# EAGLE schematic EchidnaBlack_0 (EAGLE 6.5.0)
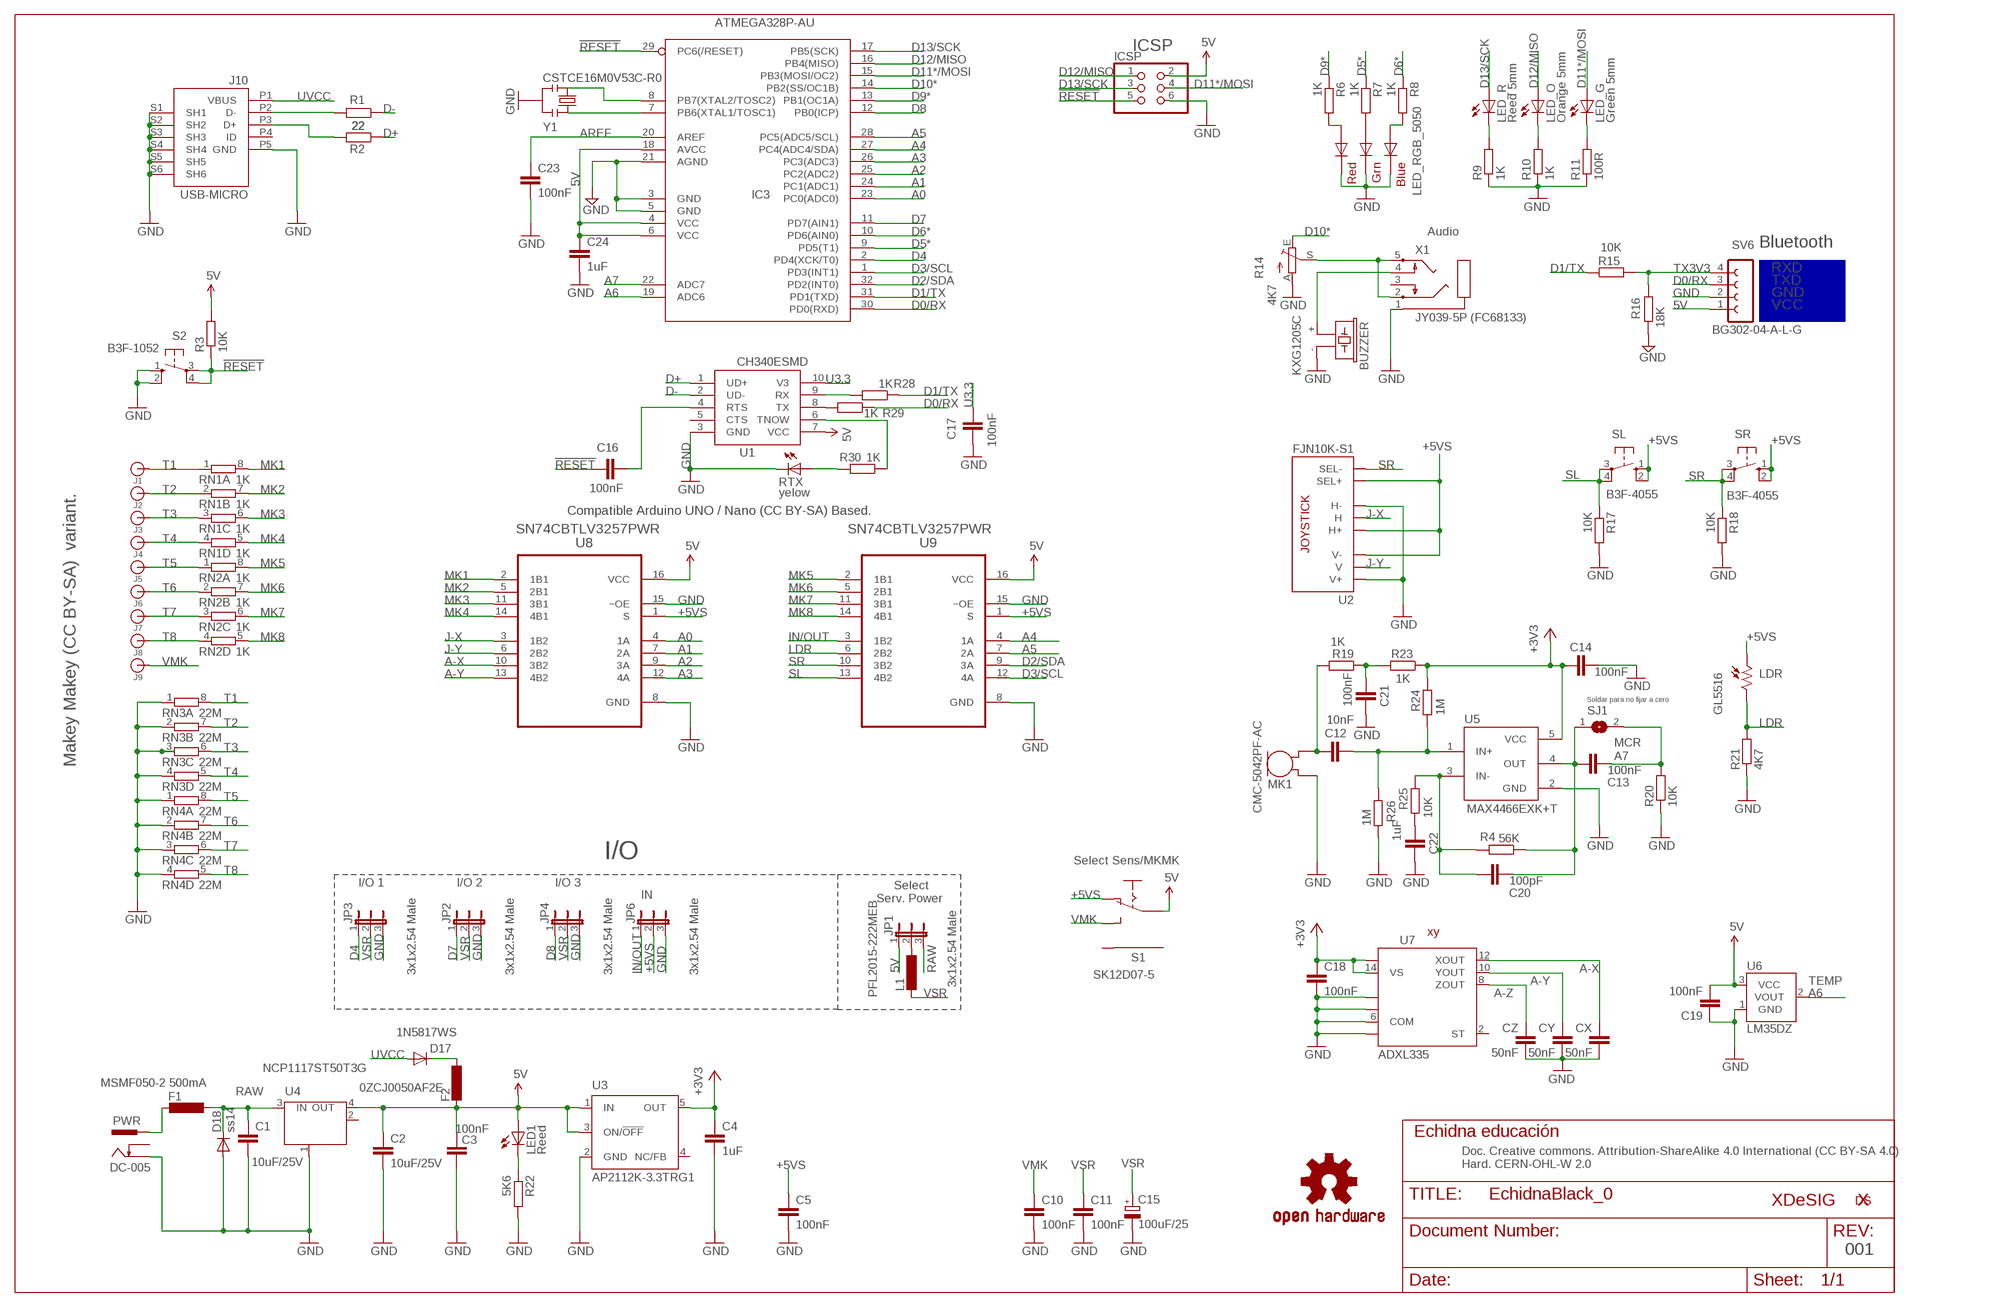
[diagram p0: schematic, sheet 1]

## Parts
BUZZER  KXG1205C  F/CM12P  [F/CM12P]
C1  10uF/25V  C-EUC1210  [C1210]
C2  10uF/25V  C-EUC1210  [C1210]
C3  100nF  CAP0603-CAP  [0603-CAP]
C4  1uF  CAP0603-CAP  [0603-CAP]
C5  100nF  C-EUC0603K  [C0603K]
C10  100nF  C-EUC0603K  [C0603K]
C11  100nF  C-EUC0603K  [C0603K]
C12  10nF  C-EUC0603K  [C0603K]
C13  100nF  C-EUC0603K  [C0603K]
C14  100nF  C-EUC0603K  [C0603K]
C15  100uF/25  CPOL-EUD  [PANASONIC_D]
C16  100nF  0015_100NF_0603  [C0603-ROUND]
C17  100nF  0015_100NF_0603  [C0603-ROUND]
C18  100nF  C-EUC0603K  [C0603K]
C19  100nF  C-EUC0603K  [C0603K]
C20  100pF  C-EUC0603K  [C0603K]
C21  100nF  C-EUC0603K  [C0603K]
C22  1uF  C-EUC0603K  [C0603K]
C23  100nF  0015_100NF_0603  [C0603-ROUND]
C24  1uF  0006_1UF_0603/GRM188R61E105KA12D  [C0603-ROUND]
CX  50nF  C-EUC0603K  [C0603K]
CY  50nF  C-EUC0603K  [C0603K]
CZ  50nF  C-EUC0603K  [C0603K]
D17  1N5817WS  DIODESOD  [SOD-323]
D18  ss14  DIODE-DO214AC  [DO214AC]
F1  MSMF050-2 500mA  L-EUL1812  [L1812]
F2  0ZCJ0050AF2E  L-EUL3216C  [L3216C]
IC3  ATMEGA328P-AU  0265_ATMEGA328P-AU  [TQFP32-08]
ICSP  0114_PH254-203DF118A00V  [2X03]
J1  Hole  BANANA_CONN  [BANANA_CONN]
J2  Hole  BANANA_CONN  [BANANA_CONN]
J3  Hole  BANANA_CONN  [BANANA_CONN]
J4  Hole  BANANA_CONN  [BANANA_CONN]
J5  Hole  BANANA_CONN  [BANANA_CONN]
J6  Hole  BANANA_CONN  [BANANA_CONN]
J7  Hole  BANANA_CONN  [BANANA_CONN]
J8  Hole  BANANA_CONN  [BANANA_CONN]
J9  Hole  BANANA_CONN  [BANANA_CONN]
J10  USB-MICRO  SMARTPRJ_MYCON2_USB-MINI-B  [SMARTPRJ_CON2_USB_MICRO_B_AT]
JP1  3x1x2.54 Male  JUMPER_JP2E  [JUMPER_JP2]
JP2  3x1x2.54 Male  JUMPER_JP2E  [JUMPER_JP2]
JP3  3x1x2.54 Male  JUMPER_JP2E  [JUMPER_JP2]
JP4  3x1x2.54 Male  JUMPER_JP2E  [JUMPER_JP2]
JP6  3x1x2.54 Male  JUMPER_JP2E  [JUMPER_JP2]
L1  PFL2015-222MEB  L-EUL3216C  [L3216C]
LDR  GL5516  A1060_34  [T0-46-A10XX]
LED1  Reed  LEDCHIPLED_0603  [CHIPLED_0603]
LED_G  Green 5mm  LED5MM  [LED5MM]
LED_O  Orange 5mm  LED5MM  [LED5MM]
LED_R  Reed 5mm  LED5MM  [LED5MM]
LED_RGB_5050  CPL6C-FKBN  [PLCC6]
LOGO1  SPARKFUN-AESTHETICS_OSHW-LOGOL  [SPARKFUN-AESTHETICS_OSHW-LOGO-L]
MK1  CMC-5042PF-AC  [CUI_CMC-5042PF-AC]
PWR  DC-005  PWR-JAKPWR_JACK_UNI_MILLING  [PWR_JACK_UNI_MILLING]
R1  22  RCL_R-EU_R0603  [RCL_R0603]
R2  22  RCL_R-EU_R0603  [RCL_R0603]
R3  10K  RCL_R-EU_R0603  [RCL_R0603]
R4  56K  RCL_R-EU_R0603  [RCL_R0603]
R6  1K  RCL_R-EU_R0603  [RCL_R0603]
R7  1K  RCL_R-EU_R0603  [RCL_R0603]
R8  1K  RCL_R-EU_R0603  [RCL_R0603]
R9  1K  RCL_R-EU_R0603  [RCL_R0603]
R10  1K  RCL_R-EU_R0603  [RCL_R0603]
R11  100R  RCL_R-EU_R0603  [RCL_R0603]
R14  4K7  TRIM_EU-CA9V  [CA9V]
R15  10K  R-EU_R0603  [R0603]
R16  18K  R-EU_R0603  [R0603]
R17  10K  RCL_R-EU_R0603  [RCL_R0603]
R18  10K  RCL_R-EU_R0603  [RCL_R0603]
R19  1K  RCL_R-EU_R0603  [RCL_R0603]
R20  10K  RCL_R-EU_R0603  [RCL_R0603]
R21  4K7  RCL_R-EU_R0603  [RCL_R0603]
R22  5K6  RCL_R-EU_R0603  [RCL_R0603]
R23  1K  RCL_R-EU_R0603  [RCL_R0603]
R24  1M  RCL_R-EU_R0603  [RCL_R0603]
R25  10K  RCL_R-EU_R0603  [RCL_R0603]
R26  1M  RCL_R-EU_R0603  [RCL_R0603]
R28  1K  R-EU_R0603  [R0603]
R29  1K  R-EU_R0603  [R0603]
R30  1K  R-EU_R0603  [R0603]
RN1  1K  RESISTOR-DIL_4R-N0603-ARC  [RESISTOR-DIL_0603-ARC]
RN2  1K  RESISTOR-DIL_4R-N0603-ARC  [RESISTOR-DIL_0603-ARC]
RN3  22M  RESISTOR-DIL_4R-N0603-ARC  [RESISTOR-DIL_0603-ARC]
RN4  22M  RESISTOR-DIL_4R-N0603-ARC  [RESISTOR-DIL_0603-ARC]
RTX  yelow  LEDCHIPLED_0603  [CHIPLED_0603]
S1  SK12D07-5  ESCORNA_SK12F14D  [ESCORNA_SK-12D07]
S2  B3F-1052  SWITCH-OMRON_10-XX  [SWITCH-OMRON_B3F-10XX]
SJ1  JUMPER_SJ  [JUMPER_SJ]
SL  B3F-4055  40-XX  [B3F-40XX]
SR  B3F-4055  40-XX  [B3F-40XX]
SV6  BG302-04-A-L-G  FE04W  [FE04W]
U1  CH340ESMD  [MSOP10]
U2  FJN10K-S1  JOYSTICKPTH  [JOYSTICK]
U3  AP2112K-3.3TRG1  LP2985-XXDBVR33  [SOT23-DBV]
U4  NCP1117ST50T3G  MC33269ST-3.3T3  [SOT223]
U5  MAX4466EXK+T  [SOT65P210X100-5N]
U6  LM35DZ  TMP36GRT-REEL7  [TO-92-]
U7  ADXL335  [LFCSP-16]
U8  SN74CBTLV3257PWR  [SOP65P640X120-16N]
U9  SN74CBTLV3257PWR  [SOP65P640X120-16N]
U$2  XY  [XY]
U$5  XDESIG21  [XDESIG]
X1  JY039-5P (FC68133)  STEREOJACK  [STX3100]
Y1  CSTCE16M0V53C-R0  0011_CSTCE16M0V53-R0  [RESONATOR]

## Nets
3V3: C4.1 C14.2 C18.1 R23.1 R24.1 U3.5(OUT) U5.5(VCC) U7.14(VS) U7.15(VS) ; supply symbol labelled +3V3
5V: C2.1 C3.2 C19.2 C24.1 F2.2 IC3.4(VCC) IC3.6(VCC) IC3.18(AVCC) ICSP.2 JP1.1 LED1.A R3.2 S1.P$1(P) SV6.1 U1.7(VCC) U3.1(IN) U3.3(ON/!OFF) U4.4(OUT) U6.3(VCC) U8.16(VCC) U9.16(VCC)
!RESET: C16.1 IC3.29(PC6(/RESET)) ICSP.5 R3.1 S2.3(P) S2.4(P1)
+5VS: C5.1 JP6.2 LDR.1 S1.P$2(O) SL.1(S) SL.2(S1) SR.1(S) SR.2(S1) U2.B1A(SEL+) U2.H1(H+) U2.V3(V-) U8.1(S) U9.1(S)
A0: IC3.23(PC0(ADC0)) U8.4(1A)
A1: IC3.24(PC1(ADC1)) U8.7(2A)
A2: IC3.25(PC2(ADC2)) U8.9(3A)
A3: IC3.26(PC3(ADC3)) U8.12(4A)
A4: IC3.27(PC4(ADC4/SDA)) U9.4(1A)
A5: IC3.28(PC5(ADC5/SCL)) U9.7(2A)
A6: IC3.19(ADC6) U6.2(VOUT)
A7: C13.2 IC3.22(ADC7) R20.2 SJ1.2
A-X: CX.1 U7.12(XOUT) U8.10(3B2)
A-Y: CY.1 U7.10(YOUT) U8.13(4B2)
A-Z: CZ.1 U7.8(ZOUT)
AREF [aref]: C23.1 IC3.20(AREF)
D0/RX: IC3.30(PD0(RXD)) R29.1 SV6.3
D1/TX: IC3.31(PD1(TXD)) R15.1 R28.1
D2/SDA: IC3.32(PD2(INT0)) U9.9(3A)
D3/SCL: IC3.1(PD3(INT1)) U9.12(4A)
D4: IC3.2(PD4(XCK/T0)) JP3.1
D5*: IC3.9(PD5(T1)) R7.1
D6*: IC3.10(PD6(AIN0)) R8.1
D7: IC3.11(PD7(AIN1)) JP2.1
D8: IC3.12(PB0(ICP)) JP4.1
D9*: IC3.13(PB1(OC1A)) R6.1
D10*: IC3.14(PB2(SS/OC1B)) R14.E
D11*/MOSI: IC3.15(PB3(MOSI/OC2)) ICSP.4 LED_G.A
D12/MISO: IC3.16(PB4(MISO)) ICSP.1 LED_O.A
D13/SCK: IC3.17(PB5(SCK)) ICSP.3 LED_R.A
D+: R2.1 U1.1(UD+)
D-: R1.1 U1.2(UD-)
DTR?: C16.2 U1.4(RTS)
GND: BUZZER.- C1.2 C2.2 C3.1 C4.2 C5.2 C10.2 C11.2 C14.1 C15.- C17.1 C18.2 C19.1 C21.1 C22.1 C23.2 C24.2 CX.2 CY.2 CZ.2 D18.A IC3.3(GND) IC3.5(GND) IC3.21(AGND) ICSP.6 J10.P5(GND) J10.S1(SH1) J10.S2(SH2) J10.S3(SH3) J10.S4(SH4) J10.S5(SH5) J10.S6(SH6) JP2.3 JP3.3 JP4.3 JP6.3 LED_RGB_5050.4(BLUE_C) LED_RGB_5050.5(GREEN_C) LED_RGB_5050.6(RED_C) MK1.GND PWR.- R9.1 R10.1 R11.1 R14.A R16.1 R17.2 R18.2 R20.1 R21.1 R22.2 R26.2 RN3.1 RN3.2 RN3.3 RN3.4 RN4.1 RN4.2 RN4.3 RN4.4 RTX.C S2.1(S) S2.2(S1) SV6.2 U1.3(GND) U2.H3(H-) U2.V1(V+) U3.2(GND) U4.1(GND/ADJ) U5.2(GND) U6.1(GND) U7.3(COM) U7.5(COM) U7.6(COM) U7.7(COM) U8.8(GND) U8.15(~OE) U9.8(GND) U9.15(~OE) X1.1 Y1.2
IN/OUT: JP6.1 U9.3(1B2)
J-X: U2.H2(H) U8.3(1B2)
J-Y: U2.V2(V) U8.6(2B2)
LDR: LDR.2 R21.2 U9.6(2B2)
MK1: RN1.8 U8.2(1B1)
MK2: RN1.7 U8.5(2B1)
MK3: RN1.6 U8.11(3B1)
MK4: RN1.5 U8.14(4B1)
MK5: RN2.8 U9.2(1B1)
MK6: RN2.7 U9.5(2B1)
MK7: RN2.6 U9.11(3B1)
MK8: RN2.5 U9.14(4B1)
N$1: C13.1 C20.2 R4.1 SJ1.1 U5.4(OUT)
N$2: C20.1 R4.2 R25.1 U5.3(IN-)
N$3: C21.2 R19.1 R23.2
N$4: C22.2 R25.2
N$5: LED_R.K(C) R9.2
N$6: LED_O.K(C) R10.2
N$7: LED_G.K(C) R11.2
N$8: R28.2 U1.9(RX)
N$9: R14.S X1.2 X1.5
N$10: BUZZER.+ X1.4
N$11: LED_RGB_5050.2(GREEN_A) R7.2
N$12: R29.2 U1.8(TX)
N$13: R30.2 RTX.A
N$14: J10.P2(D-) R1.2
N$15: JP1.2 L1.1
N$16: J10.P3(D+) R2.2
N$17: F1.2 PWR.+
N$18: LED1.C R22.1
N$19: C12.1 MK1.OUT R19.2
N$20: D17.1(C) F2.1
N$22: C12.2 R24.2 R26.1 U5.1(IN+)
N$23: LED_RGB_5050.1(RED_A) R6.2
N$24: LED_RGB_5050.3(BLUE_A) R8.2
N$25: R30.1 U1.6(TNOW)
N$26: IC3.7(PB6(XTAL1/TOSC1)) Y1.1
N$27: IC3.8(PB7(XTAL2/TOSC2)) Y1.3
RAW: C1.1 D18.C F1.1 JP1.3 U4.3(IN)
SL: R17.1 SL.3(P) SL.4(P1) U9.13(4B2)
SR: R18.1 SR.3(P) SR.4(P1) U2.B2A(SEL-) U9.10(3B2)
T1: J1.P$1 RN1.1 RN3.8
T2: J2.P$1 RN1.2 RN3.7
T3: J3.P$1 RN1.3 RN3.6
T4: J4.P$1 RN1.4 RN3.5
T5: J5.P$1 RN2.1 RN4.8
T6: J6.P$1 RN2.2 RN4.7
T7: J7.P$1 RN2.3 RN4.6
T8: J8.P$1 RN2.4 RN4.5
TX3V3: R15.2 R16.2 SV6.4
U3,3: C17.2 U1.10(V3)
UVCC: D17.2(A) J10.P1(VBUS)
VMK: C10.1 J9.P$1 S1.P$3(S)
VSR: C11.1 C15.+ JP2.2 JP3.2 JP4.2 L1.2
Unconnected: J10.P4(ID) PWR.-- S1.P$4 S1.P$5 U1.5(CTS) U3.4(NC/FB) U4.2(OUT) U7.2(ST) X1.3

## Notes on the sheet
- ICSP
- Audio
- Bluetooth
- RXD
- TXD
- GND
- VCC
- Makey Makey (CC BY-SA)  variant.
- Compatible Arduino UNO / Nano (CC BY-SA) Based.
- Soldar para no fijar a cero
- MCR
- I/O
- Select Sens/MKMK
- I/O 1 | I/O 2 | I/O 3
- Select
  Serv. Power
- IN
- TEMP
- Echidna educación
- Doc. Creative commons. Attribution-ShareAlike 4.0 International (CC BY-SA 4.0)
  Hard. CERN-OHL-W 2.0
- XDeSIG
- 001

## Library data of the parts
BUZZER = buzzer:F/CM12P: BUZZER Source: Buerklin; OC_FARNELL: unknown; OC_NEWARK: unknown
C1 C2 C5 C10-C14 C18-C22 CX CY CZ = rcl:C-EU: CAPACITOR, European symbol
C3 C4 = SparkFun:CAP: Capacitor Standard 0603 ceramic capacitor, and 0.1" leaded capacitor.
C15 = rcl:CPOL-EU: POLARIZED CAPACITOR, European symbol
C16 C17 C23 = Condensatori:0015_100NF_0603: 100nF 0603 50V; CASE: 0603; MONTHLY_USAGE: _____; PART_NUMBER: cl10b104kbnc; PRICE: _____; SUPPLIER: _____; TYPE: Condensatori
C24 = Condensatori:0006_1UF_0603/GRM188R61E105KA12D: 1uF 0603; CASE: 0603; MONTHLY_USAGE: _____; PART_NUMBER: 1uF_0603/GRM188R61E105KA12D; PRICE: _____; SUPPLIER: _____; TYPE: Condensatori
D17 = SparkFun:DIODE: Diode These are standard reverse protection diodes and small signal diodes. SMA package can handle up to about 1A. SOD-323 can handle about 200mA. What the SOD-323 package when ordering, there are some mfgs out there that are 5-pin packages.
D18 = diode:DIODE-: DIODE
F1 F2 L1 = rcl:L-EU: INDUCTOR, European symbol
IC3 = IntegratedCircuits:0265_ATMEGA328P-AU: 8-bit Microcontroller with 32KBytes In-System Programmable Flash ATMEGA328P-AU; CASE: TQFP32_7x7; MONTHLY_USAGE: _____; PART_NUMBER: ATMEGA328P-AU; PRICE: _____; SUPPLIER: _____; TYPE: Circuito_Integrato
ICSP = Connettori:0114_PH254-203DF118A00V: 3x2 M V h 8,5 mm p2,54; MONTHLY_USAGE: _____; PART_NUMBER: PH254-203DF118A00V; PRICE: _____; SUPPLIER: _____; TYPE: Connettori; VALUE: ICSP
J1-J9 = SparkFun-Connectors:BANANA_CONN: Through-hole banana jack
J10 = cervus2.001:SMARTPRJ_MYCON2_USB-MINI-B
JP1-JP4 JP6 = escorna_ELIB:JUMPER_JP2E: JUMPER
LDR = photo-elements:A10: Sensor Robust Light Sensing Applications Outdoor Light Sensing Application Source: http://optoelectronics.perkinelmer.com/content/Datasheets/DTS_PhotocellsA1050.pdf
LED1 LED_G LED_O LED_R = led:LED: LED
LED_RGB_5050 = Echidna_shield_LBR:CPL6C-FKB
LOGO1 = escorna_LBREscorna_CPU_2_10:SPARKFUN-AESTHETICS_OSHW-LOGO: Open Source Hardware Logo This logo indicates the piece of hardware it is found on incorporates a OSHW license and/or adheres to the definition of open source hardware found here: http://freedomdefined.org/OSHW
MK1 = CMC-5042PF-AC:CMC-5042PF-AC: 6.0 mm, Omnidirectional, PCB Mount, 2.0 Vdc, Electret Condenser Microphone; AVAILABILITY: Unavailable; CUI_PURCHASE_URL: https://www.cui.com/product/audio/microphones/electret-condenser-microphones/cmc-5042pf-ac?utm_source=snapeda.com&utm_medium=referral&utm_campaign=snapedaBOM; DESCRIPTION: 6.0 mm, Omnidirectional, PCB Mount, 2.0 Vdc, Electret Condenser Microphone; MF: CUI Inc.; MP: CMC-5042PF-AC; PACKAGE: CUI Inc.; PRICE: None
PWR = gogo:PWR-JAK
R1-R4 R6-R11 R17-R26 = escorna_LBREscorna_CPU_2_10:RCL_R-EU_: RESISTOR, European symbol
R14 = pot:TRIM_EU-: POTENTIOMETER
R15 R16 R28-R30 = rcl:R-EU_: RESISTOR, European symbol
RN1-RN4 = escorna_LBREscorna_CPU_2_10:RESISTOR-DIL_4R-N: Array Chip Resistor Source: RS Component / Phycomp; OC_FARNELL: unknown; OC_NEWARK: unknown
RTX = adafruit:LED: LED
S1 = escorna_ELIB:ESCORNA_SK12F14
S2 = escorna_ELIB:SWITCH-OMRON_10-XX: OMRON SWITCH; MPN: B3F-1000; OC_FARNELL: 176432; OC_NEWARK: 36M3542
SJ1 = cervus2.100:JUMPER_SJ: SMD solder JUMPER
SL SR = Pulsadores Juan García:40-XX: OMRON SWITCH; MF: OMRON COMPONENTS USA; MPN: B3F-4000; OC_FARNELL: 176434; OC_NEWARK: 36K3105
SV6 = con-lsta:FE04W
U1 = CH340E:CH340E: WCH.CN/CH340E See DataSheet： wch.cn <http://www.wch.cn/downloads/CH340DS1_PDF.html>; AVAILABILITY: Unavailable; DESCRIPTION: USB to serial chip CH340; MF: WCH; MP: CH340E; PACKAGE: Package Analog Devices; PRICE: None
U2 = Juan Garcia-Electromechanical:JOYSTICK: Thumb Joystick Joystick commonly found in PS2 controllers. Two pots and a select switch. Footprint proven. Spark Fun Electronics SKU : COM-09032
U3 = SmartPrj:LP2985-XXDBVR: ULTRALOW-POWER 50-mA LOW-DROPOUT LINEAR REGULATORS 50-mA Low-Dropout Regulator Source: http://focus.ti.com/lit/ds/symlink/tps77001.pdf
U4 = linear:MC33269ST*: Adjustable Output Low Dropout Voltage Regulator 800 mA Source: http://www.onsemi.com/pub/Collateral/MC33269-D.PDF
U5 = MAX4466EXK_T:MAX4466EXK+T: Audio Amp Microphone 1-CH Mono Class-AB 5-Pin SC-70 T/R; AVAILABILITY: Unavailable; DESCRIPTION: Audio Amp Microphone 1-CH Mono Class-AB 5-Pin SC-70 T/R; MF: Maxim Integrated; MP: MAX4466EXK+T; PACKAGE: SC-70-5 Maxim; PRICE: None
U6 = TMP36GRT-REEL7:TMP36GRT-REEL7: Precision degC temp sensor, analog out
U7 = ADXL335:ADXL335: 3-axis, 3g accelerometer, analog out; AVAILABILITY: Unavailable; DESCRIPTION: Accelerometer Triple ±3g 1.8V to 3.6V 270mV/g to 330mV/g 16-Pin LFCSP EP Tray; MF: Analog Devices; MP: ADXL335BCPZ; PACKAGE: LFCSP-16 Analog Devices; PRICE: None
U8 U9 = SN74CBTLV3257PWR:SN74CBTLV3257PWR: 4Bit IC MUX/DEMUX; AVAILABILITY: Unavailable; DESCRIPTION: Low-Voltage 4-Bit 1-Of-2 FET Multiplexer/Demultiplexer 16-TSSOP -40 to 85; MF: Texas Instruments; MP: SN74CBTLV3257PWR; PACKAGE: TSSOP-16 Texas Instruments; PRICE: None
U$2 = xdesig:XY
U$5 = xdesig:XDESIG
X1 = adafruit:STEREOJACK: MIC/HEADPHONE JACK Stereo jack with two switches. Kycon STX3100, CUI SJ1-3555NG and/or 4UCon 05544
Y1 = Cristalli:0011_CSTCE16M0V53-R0: 16Mhz - SMD; MONTHLY_USAGE: _____; PART_NUMBER: CSTCE16M0V53-R0; PRICE: _____; SUPPLIER: _____; TYPE: Cristalli; VALUE: CSTCE16M0V53-R0

## Net classes
0 default: width 0.254 mm, drill 0.61 mm, clearance 0.254 mm
1 power: width 0.254 mm, drill 0.61 mm, clearance 0.254 mm
2 gnd: width 0.254 mm, drill 0.61 mm, clearance 0.254 mm
4 aref: width 0.254 mm, drill 0.61 mm, clearance 0.254 mm